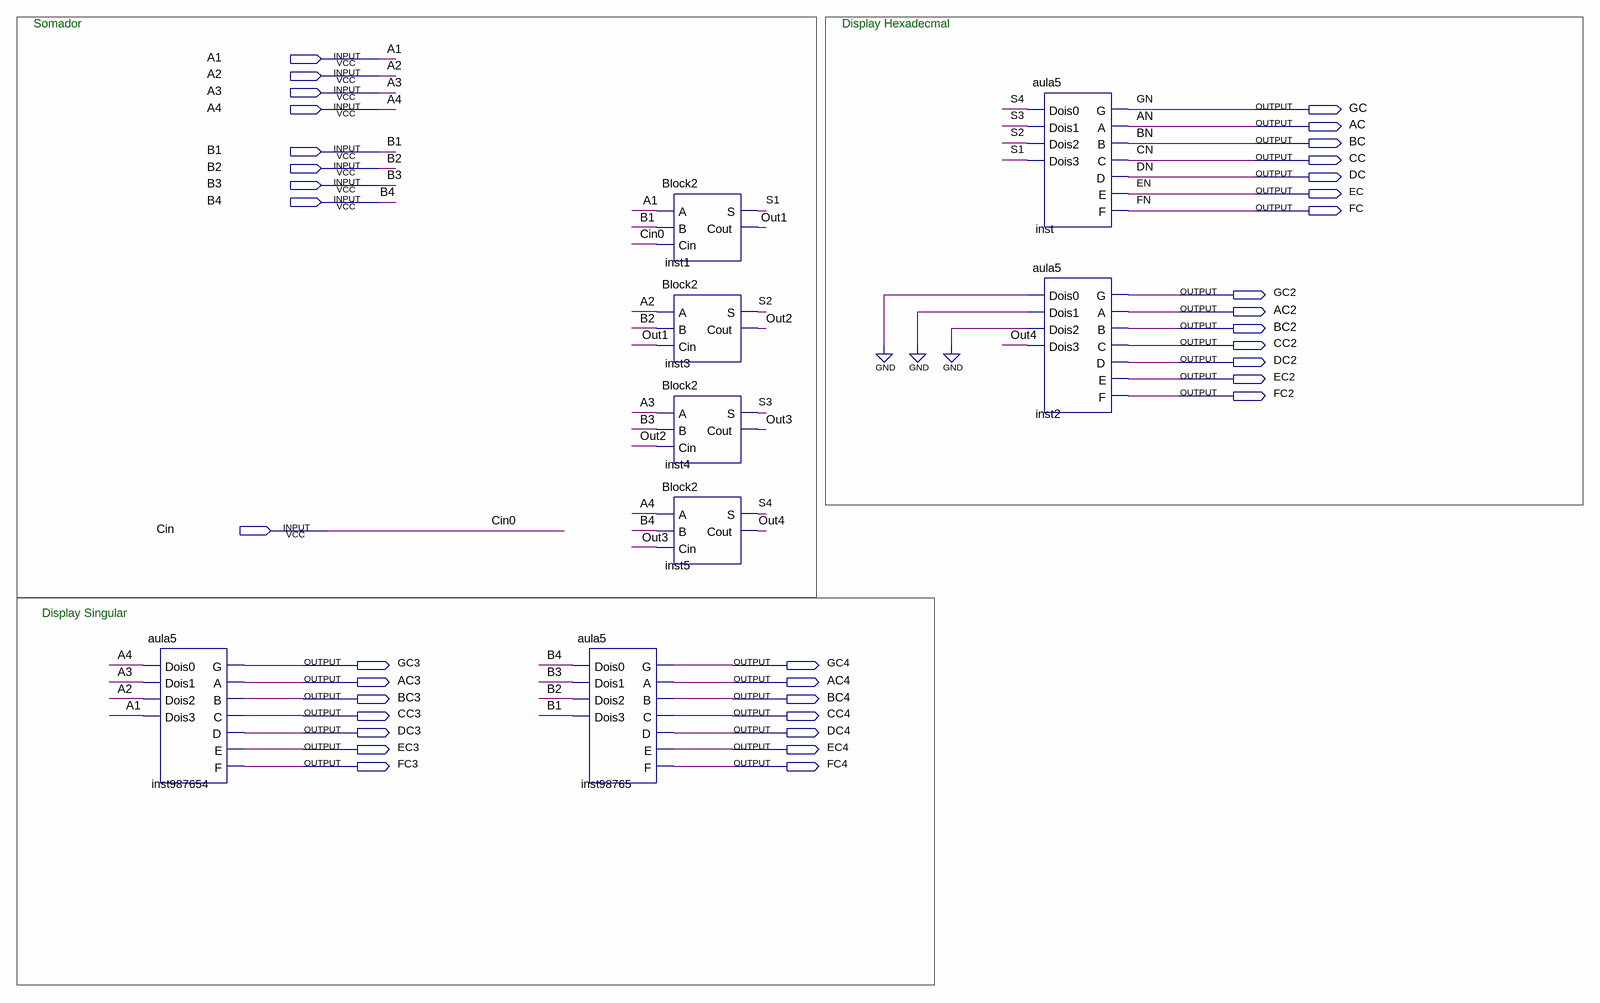
[diagram p0: schematic sheet]
// Quartus schematic aula6.bdf as structural Verilog: 8 symbols, 37 pins
module aula6 (
  input  A1,
  input  A2,
  input  A3,
  input  A4,
  input  B1,
  input  B2,
  input  B3,
  input  B4,
  input  Cin,
  output GC,
  output AC,
  output BC,
  output CC,
  output DC,
  output EC,
  output FC,
  output GC2,
  output AC2,
  output BC2,
  output CC2,
  output DC2,
  output EC2,
  output FC2,
  output GC3,
  output GC4,
  output AC3,
  output AC4,
  output BC3,
  output BC4,
  output CC3,
  output CC4,
  output DC3,
  output DC4,
  output EC3,
  output EC4,
  output FC3,
  output FC4
);

  wire Out1, Out2, Out3, Out4, S1, S2, S3, S4;

  aula5 inst987654 (
    .Dois0(A4), .Dois1(A3), .Dois2(A2), .Dois3(A1), .G(GC3), .A(AC3), .B(BC3), .C(CC3), .D(DC3), .E(EC3),
    .F(FC3));
  aula5 inst98765 (
    .Dois0(B4), .Dois1(B3), .Dois2(B2), .Dois3(B1), .G(GC4), .A(AC4), .B(BC4), .C(CC4), .D(DC4), .E(EC4),
    .F(FC4));
  Block2 inst1 (.A(A1), .B(B1), .Cin(Cin), .S(S1), .Cout(Out1));
  Block2 inst3 (.A(A2), .B(B2), .Cin(Out1), .S(S2), .Cout(Out2));
  Block2 inst4 (.A(A3), .B(B3), .Cin(Out2), .S(S3), .Cout(Out3));
  Block2 inst5 (.A(A4), .B(B4), .Cin(Out3), .S(S4), .Cout(Out4));
  aula5 inst (.Dois0(S4), .Dois1(S3), .Dois2(S2), .Dois3(S1), .G(GC), .A(AC), .B(BC), .C(CC), .D(DC), .E(EC), .F(FC));
  aula5 inst2 (
    .Dois0(1'b0), .Dois1(1'b0), .Dois2(1'b0), .Dois3(Out4), .G(GC2), .A(AC2), .B(BC2), .C(CC2), .D(DC2),
    .E(EC2), .F(FC2));

  // Other names for the same wires on the sheet: AN = AC; BN = BC; Cin0 = Cin; CN = CC; DN = DC; EN = EC; FN = FC;
  //   GN = GC

  // Notes on the sheet:
  //   Somador
  //   Display Hexadecmal
  //   Display Singular
endmodule
